# EAGLE design Adafruit 0.96in 160x80 TFT Display (EAGLE 6.4)
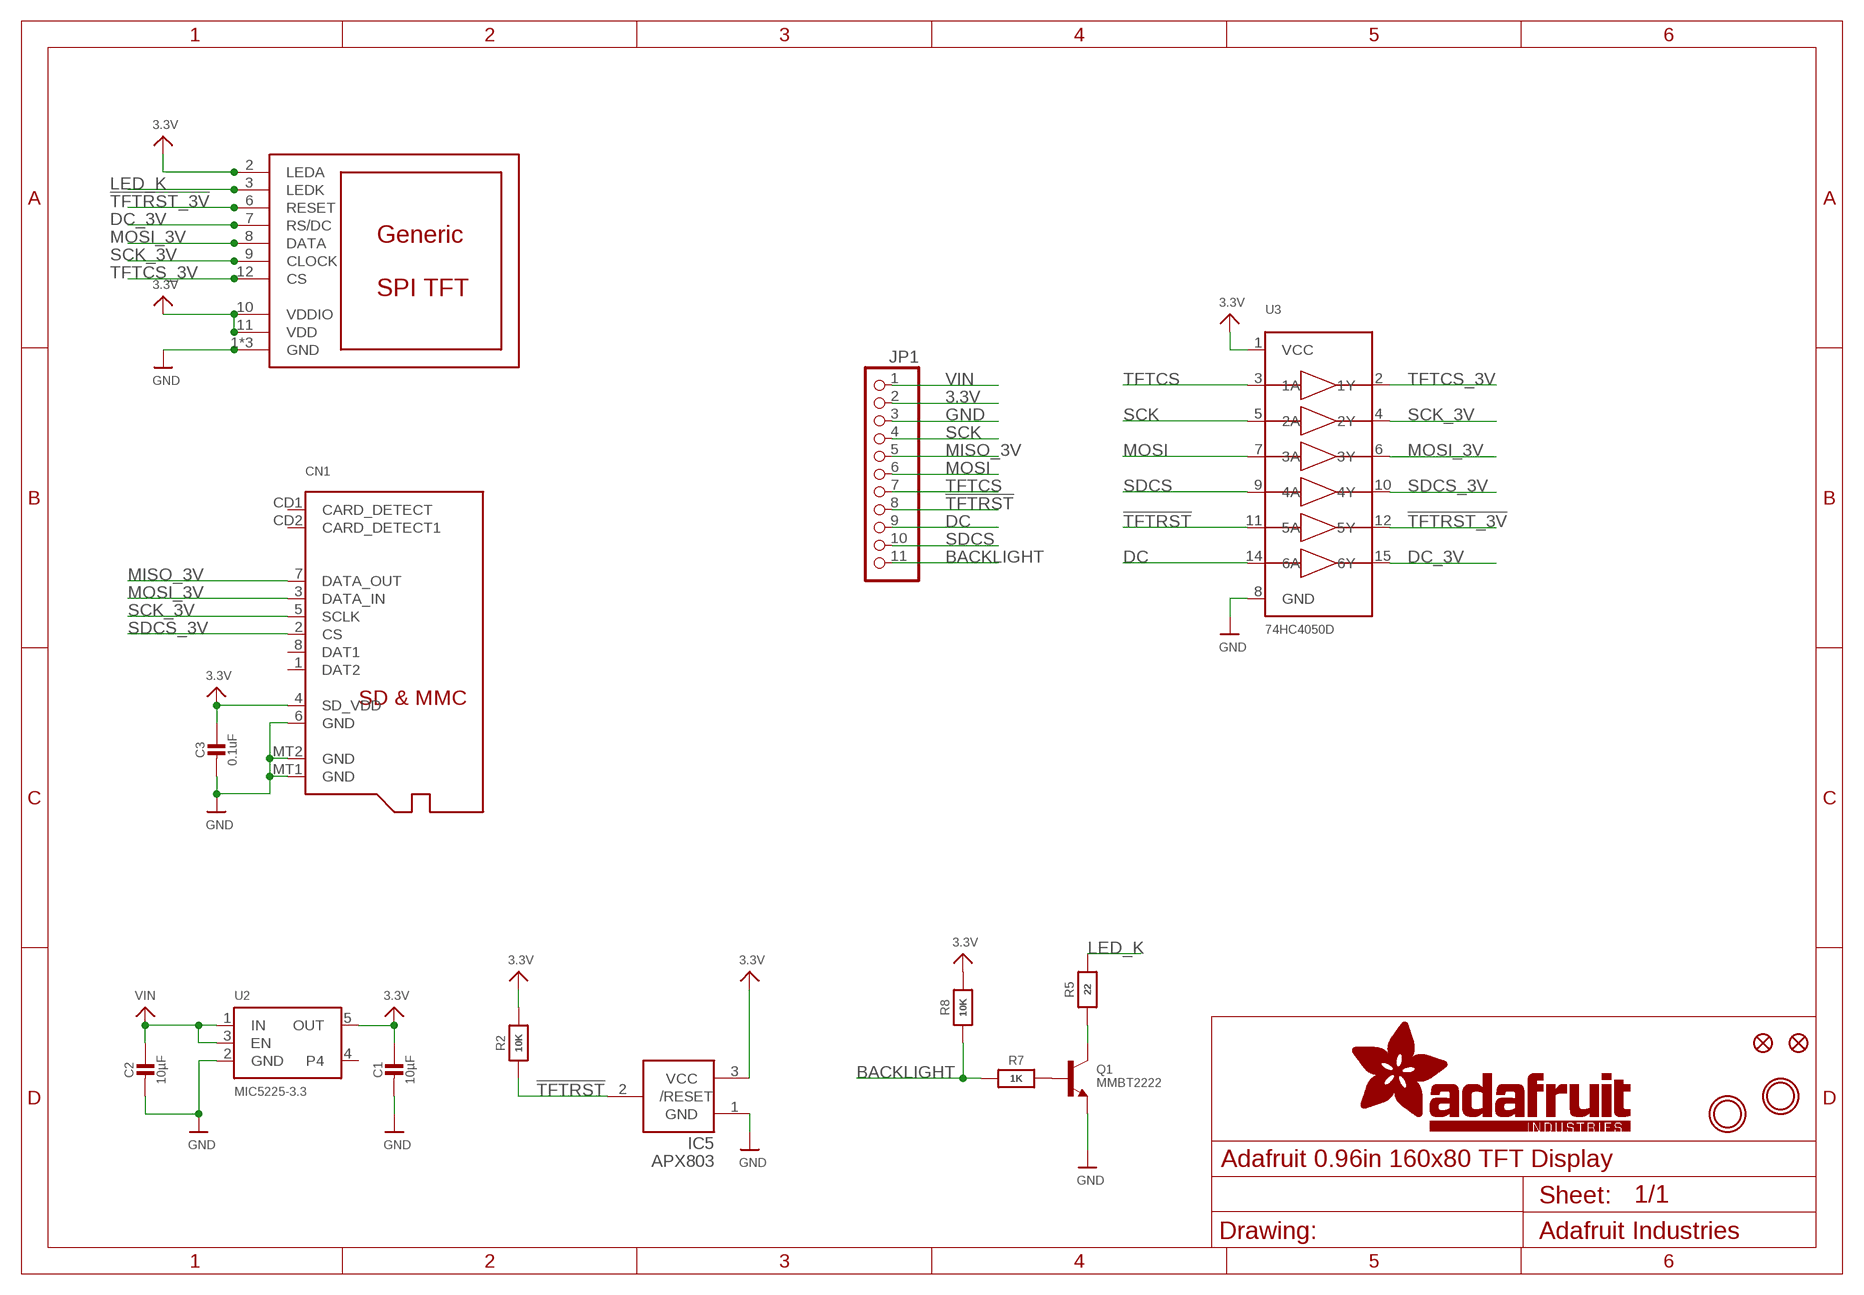
[diagram p0: schematic, sheet 1]

## Parts
C1  10µF  CAP_CERAMIC0805-NOOUTLINE  [0805-NO]
C2  10µF  CAP_CERAMIC0805-NOOUTLINE  [0805-NO]
C3  0.1uF  CAP_CERAMIC0805-NOOUTLINE  [0805-NO]
CN1  MICROSD  [MICROSD]
FID1  FIDUCIAL_1MM  [FIDUCIAL_1MM]
FID2  FIDUCIAL_1MM  [FIDUCIAL_1MM]
IC5  APX803  AXP083-SAG  [SOT23]
JP1  HEADER-1X11  [1X11_ROUND]
Q1  MMBT2222  TRANSISTOR_NPNWIDE  [SOT23-WIDE]
R2  10K  RESISTOR_0603_NOOUT  [0603-NO]
R5  22  RESISTOR_0603_NOOUT  [0603-NO]
R7  1K  RESISTOR_0603_NOOUT  [0603-NO]
R8  10K  RESISTOR_0603_NOOUT  [0603-NO]
U2  MIC5225-3.3  VREG_SOT23-5  [SOT23-5]
U3  74HC4050D  [SOIC16]
U$2  DISP_LCD_0.9IN_160X80  [TFT_0.96IN_160X80]
U$9  MOUNTINGHOLE2.5  [MOUNTINGHOLE_2.5_PLATED]
U$10  MOUNTINGHOLE2.5  [MOUNTINGHOLE_2.5_PLATED]

## Nets
3.3V: C1.1 C3.1 CN1.4(SD_VDD) IC5.3(VCC) JP1.2 R2.2 R8.2 U2.5(OUT) U3.1(VCC) U$2.2(LEDA) U$2.10(VDDIO) U$2.11(VDD)
!TFTRST: IC5.2(/RESET) JP1.8 R2.1 U3.11(5A)
!TFTRST_3V: U3.12(5Y) U$2.6(RESET)
BACKLIGHT: JP1.11 R7.1 R8.1
DC: JP1.9 U3.14(6A)
DC_3V: U3.15(6Y) U$2.7(RS/DC)
GND: C1.2 C2.2 C3.2 CN1.6(GND) CN1.MT1(GND) CN1.MT2(GND) IC5.1(GND) JP1.3 Q1.2(E) U2.2(GND) U3.8(GND) U$2.1(GND) U$2.5(GND) U$2.13(GND)
LED_K: R5.2 U$2.3(LEDK)
MISO_3V: CN1.7(DATA_OUT) JP1.5
MOSI: JP1.6 U3.7(3A)
MOSI_3V: CN1.3(DATA_IN) U3.6(3Y) U$2.8(DATA)
N$1: Q1.1(B) R7.2
N$5: Q1.3(C) R5.1
SCK: JP1.4 U3.5(2A)
SCK_3V: CN1.5(SCLK) U3.4(2Y) U$2.9(CLOCK)
SDCS: JP1.10 U3.9(4A)
SDCS_3V: CN1.2(CS) U3.10(4Y)
TFTCS: JP1.7 U3.3(1A)
TFTCS_3V: U3.2(1Y) U$2.12(CS)
VIN: C2.1 JP1.1 U2.1(IN) U2.3(EN)
Unconnected: CN1.1(DAT2) CN1.8(DAT1) CN1.CD1(CARD_DETECT) CN1.CD2(CARD_DETECT1) U2.4

## Library data of the parts
C1-C3 = microbuilder:CAP_CERAMIC: Ceramic Capacitors For new designs, use the packages preceded by an '_' character since they are more reliable: The following footprints should be used on most boards: _0402 - Standard footprint for regular board layouts _0603 - Standard footprint for regular board layouts _0805 - Standard footprint for regular board layouts _1206 - Standard footprint for regular board layouts For extremely tight-pitch boards where space is at a premium, the following 'micro-pitch' footprints can be used (smaller pads, no silkscreen outline, etc.): _0402MP - Micro-pitch footprint for very dense/compact boards _0603MP - Micro-pitch footprint for very dense/compact boards _0805MP - Micro-pitch footprint for very dense/compact boards _1206MP - Micro-pitch footprint for very dense/compact boards
CN1 = microbuilder:MICROSD: MicroSD/Transflash Card Holder with SPI pinout 3M: 2908-05WB-MG 4UConnector: 19656 Footprint courtesy: Adafruit Industries
FID1 FID2 = microbuilder:FIDUCIAL: Fiducial Alignment Points Various fiducial points for machine vision alignment.; BOM: EXCLUDE
IC5 = adafruit:AXP083
JP1 = microbuilder:HEADER-1X11
Q1 = microbuilder:TRANSISTOR_NPN: NPN Transistor Transistor (NPN) 500mA 45V - BC817 [Digikey: 568-1631-1-ND] Transistor (NPN) 500mA 45V - BC817,215 [Mouser: 771-BC817-T/R] SOT23-R - SOT23 footprint optimised for use with solder paste and reflow ovens. SOT23-W - SOT23 footprint optimised for hand-soldering (larger pads).
R2 R5 R7 R8 = microbuilder:RESISTOR: Resistors For new designs, use the packages preceded by an '_' character since they are more reliable: The following footprints should be used on most boards: _0402 - Standard footprint for regular board layouts _0603 - Standard footprint for regular board layouts _0805 - Standard footprint for regular board layouts _1206 - Standard footprint for regular board layouts For extremely tight-pitch boards where space is at a premium, the following 'micro-pitch' footprints can be used (smaller pads, no silkscreen outline, etc.): _0402MP - Micro-pitch footprint for very dense/compact boards _0603MP - Micro-pitch footprint for very dense/compact boards _0805MP - Micro-pitch footprint for very dense/compact boards _1206MP - Micro-pitch footprint for very dense/compact boards
U2 = microbuilder:VREG_SOT23-5: SOT23-5 Fixed Voltage Regulators Part Current Out V Out V In V Dropout θJA (°C/W) TJ (°C) Digikey Part No. ADP121 150mA 3.3V 3.4-5.5V 0.09V @ 150mA -- -- ADP121-AUJZ33R7CT-ND ADP121 150mA 3.0V 3.1-5.5V 0.09V @ 150mA -- -- ADP121-AUJZ30R7CT-ND ADP122 300mA 3.3V 3.4-5.5V 0.085V @ 300mA -- -- ADP122AUJZ-3.3-R7CT-ND ADP1712 300mA 3.3V 3.5-5.5V 0.17V @ 300mA -- -- ADP1712AUJZ-3.3-R7TR-ND AP7311 (Low Cost) 150mA 3.3V 3.5-6V 0.15V @ 150mA -- -- AP7311-33WG-7DICT-ND LD39015M18R 150mA 1.8V 1.9V-5.5V 0.08V @ 100mA -- -- 497-6977-1-ND LP2985A-33DBVR 150mA 3.3V 3.3-16V 0.28V @ 150mA 206 150 296-18479-1-ND MCP1824T-3302E/OT 300mA 3.3V 3.5V-6V 0.2V @ 300mA -- -- MCP1824T-3302E/OTCT-ND MIC5205-2.5YM5 TR 150mA 2.5V 2.7-16V 0.165V @ 150mA -- -- 576-1257-2-ND MIC5205-3.0YM5 TR 150mA 3.0V 3.2V-16V 0.165V @ 150mA -- -- 576-1258-2-ND MIC5205-3.3YM5 TR 150mA 3.3V 3.5V-16V 0.165V @ 150mA -- -- 576-1259-2-ND TPS780330220 150mA 3.3V+2.2V 3.6-5.5V 250mV Max -- -- 296-23332-1-ND TDA3663/N1,135 100mA 3.3V 3.5-45V 0.18V @ 50mA -- -- 568-5343-1-ND Max operating temp can be calculated using θJA, TJ (max junction temperature), and power in watts. Set the "Maximum Ambient Temperature" until it reaches TJ ("Max Junction Temperature"), which is the absolute limit for safe use of the regulator: Heat Sink Temperature Calculator <http://www.daycounter.com/Calculators/Heat-Sink-Temperature-Calculator.phtml> For example, With 12V source into a 3.3V LP2985 and a 30mA load, we are dissipating (12V-3.3V) * 0.03A = 0.261W. With a θJA of 206 °C/W, a TJ of 150°C, and 261mW we can safely use the chip without a heat sink up to 75°C (=147.1°C Junction Temperature).
U3 = microbuilder:74HC4050D: 6-channel level shifter 74HC4050D - 2V-6V Supply SOIC16 Digikey: 74HC4050D,653-ND Mouser: 771-74HC4050D-T TSSOP16 Digikey: 296-9215-1-ND Mouser:
U$2 = microbuilder:DISP_LCD_0.9IN_160X80
U$9 U$10 = microbuilder:MOUNTINGHOLE: Mounting Hole For #2 screws (0.086"/2.18mm width, 0.094"/2.4mm hole) use 2.5mm; BOM: EXCLUDE

## Board
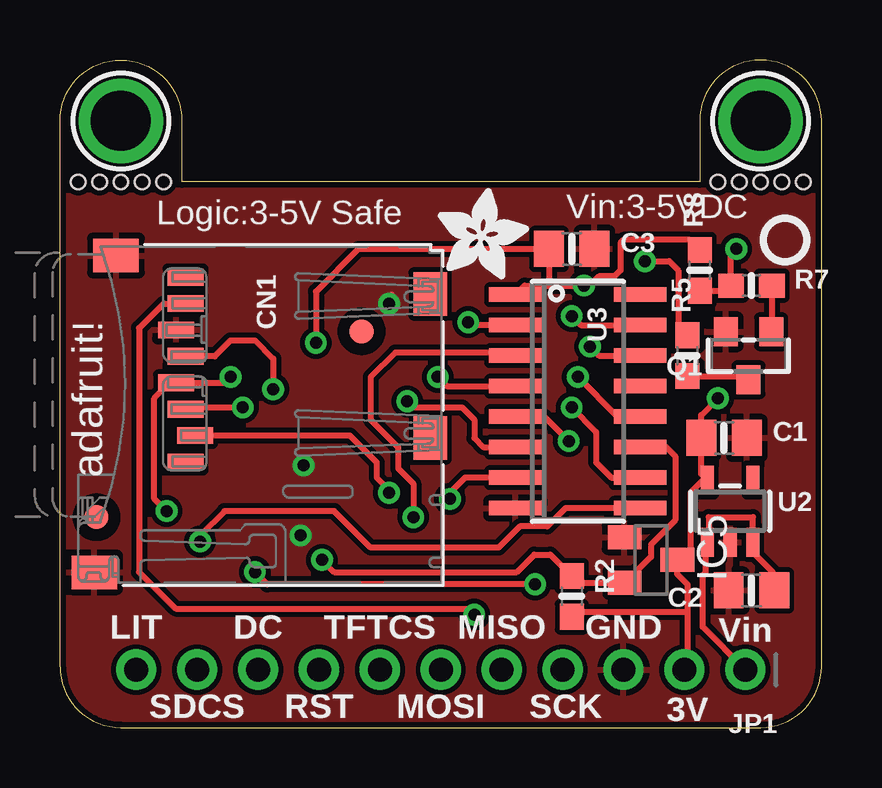
[diagram p1: board, top side]
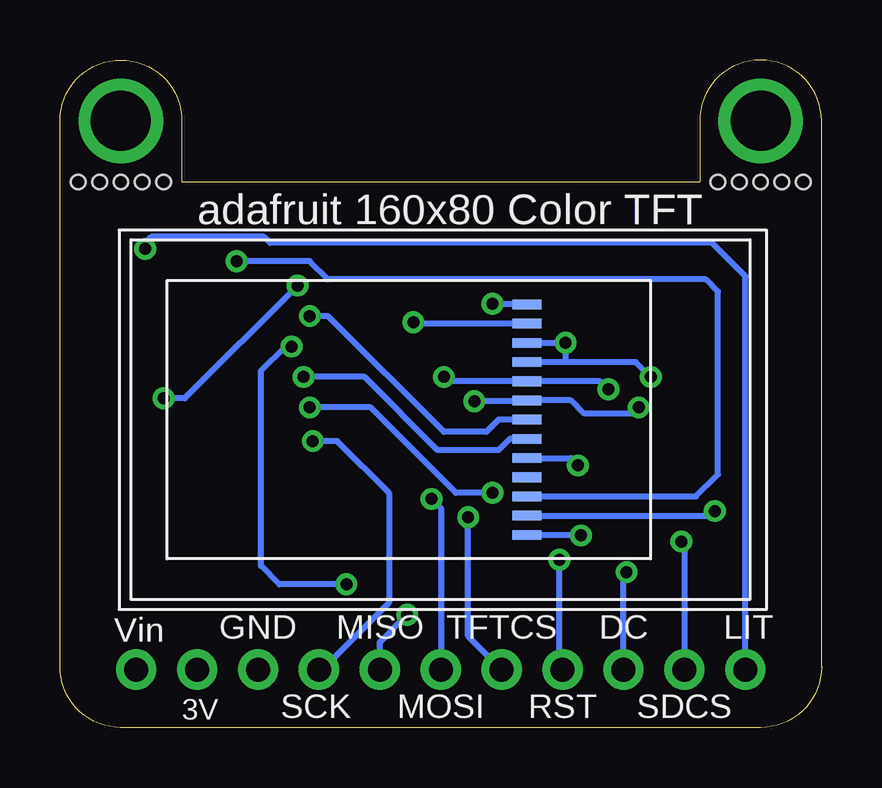
[diagram p2: board, bottom side, seen from below]

Size 31.75 x 27.81 mm. Coordinates in mm from the lower left corner, seen from the top.
Outline: 0,2.54 0,25.27 arc-90 2.54,27.81 arc-90 5.08,25.27 5.08,22.73 26.67,22.73 26.67,25.27 arc-90 29.21,27.81 arc-90 31.75,25.27 31.75,2.54 arc-90 29.21,0 2.54,0 arc-90 0,2.54
Copper layers (1*16): Top 0.035mm / dielectric 1.5mm / Bottom 0.035mm
Design rules "adafruit *": minimum track width 8mil, minimum drill 15.5mil, track to track 8mil, track to pad 8mil, pad to pad 8mil, via to via 8mil, smd to smd 8mil, copper to edge 10mil, drill to drill 8mil, minimum pad ring 10mil, minimum via ring 8mil, stop-mask expansion 2mil, vias tented up to drill 20mil, thermal gap 10mil
Holes 0.6 mm at 4.32,22.73 3.43,22.73 2.54,22.73 1.65,22.73 0.76,22.73 30.99,22.73 30.1,22.73 29.21,22.73 28.32,22.73 27.43,22.73

### Footprints (pad centres in the part's own frame; a part is rotated, then mirrored left to right if it is on the bottom)
0805-NO = smd 1.24 x 1.5: 1 -0.95,0; 2 0.95,0
MICROSD = smd 0.7 x 1.5: 1 9,-10.64; 2 7.9,-10.24; 3 6.8,-10.64; 4 5.7,-11.04; 5 4.6,-10.64; 6 3.5,-11.04; 7 2.4,-10.64; 8 1.3,-10.64 | smd 1.8 x 1.4: CD1 2,-0.44; CD2 8,-0.44 | smd 1.4 x 1.9: MT1 0.4,-13.54; MT2 13.6,-14.44
FIDUCIAL_1MM = smd 1 x 1: 1 0,0
SOT23 = smd 1 x 1.4: 1 -0.95,-1.1; 2 0.95,-1.1; 3 0,1.1
1X11_ROUND = drill 1 pad 1.676: 1 -12.7,0; 2 -10.16,0; 3 -7.62,0; 4 -5.08,0; 5 -2.54,0; 6 0,0; 7 2.54,0; 8 5.08,0; 9 7.62,0; 10 10.16,0; 11 12.7,0
SOT23-WIDE = smd 1 x 1.2: 1 -0.95,-1; 2 0.95,-1; 3 0,1
0603-NO = smd 1.075 x 1: 1 -0.85,0; 2 0.85,0
SOT23-5 = smd 0.55 x 1.2: 1 -0.95,-1.3; 2 0,-1.3; 3 0.95,-1.3; 4 0.95,1.3; 5 -0.95,1.3
SOIC16 = smd 0.6 x 2.2: 1 -4.445,-2.6; 2 -3.175,-2.6; 3 -1.905,-2.6; 4 -0.635,-2.6; 5 0.635,-2.6; 6 1.905,-2.6; 7 3.175,-2.6; 8 4.445,-2.6; 9 4.445,2.6; 10 3.175,2.6; 11 1.905,2.6; 12 0.635,2.6; 13 -0.635,2.6; 14 -1.905,2.6; 15 -3.175,2.6; 16 -4.445,2.6
TFT_0.96IN_160X80 = smd 0.4 x 1.2: 1 -4.8,10; 2 -4,10; 3 -3.2,10; 4 -2.4,10; 5 -1.6,10; 6 -0.8,10; 7 0,10; 8 0.8,10; 9 1.6,10; 10 2.4,10; 11 3.2,10; 12 4,10; 13 4.8,10
MOUNTINGHOLE_2.5_PLATED = drill 2.5 pad 3.2: P$1 0,0

### Placement (x,y rotation side)
C1  27.69,12.06 0 top
C2  28.83,5.71 180 top
C3  21.34,19.94 0 top
CN1  15.88,20.07 270 top
FID1  1.52,8.76 0 top
FID2  12.57,16.51 0 top
IC5  24.64,6.98 270 top
JP1  15.88,2.41 180 top
Q1  28.7,15.49 180 top
R2  21.34,5.46 270 top
R5  26.16,15.49 90 top
R7  28.83,18.41 0 top
R8  26.67,19.05 90 top
U2  27.94,9.02 0 top
U3  21.59,13.59 270 top
U$2  2.29,12.83 90 bottom
U$4  MICROSD  [ADAFRUIT_3.5MM]  15.75,18.67 0 top
U$6  [PCBFEAT-REV-040]  30.23,20.32 0 top
U$9  2.54,25.27 0 top
U$10  29.21,25.27 0 top

### Tracks (layer width: path | path; a pad name or v marks a point on that pad's centre or on a via)
3.3V  (via drill 0.5)
  Top 0.254: v10.67,16.03 10.67,18.16 12.45,19.94 C3.1 20.39,18.41 | 18.29,18.16 19.12,18.16 U3.1 19.37,18.41 20.39,18.41 | 26.16,4.83 26.16,5.97 25.74,6.39 IC5.3 26.29,6.98 26.29,9.78 26.83,10.32 U2.5 26.74,10.57 C1.1 26.74,13.02 v27.43,13.72 | 26.16,4.83 26.16,2.54 JP1.2 | 20.39,18.41 v21.84,18.41 | v4.45,9.02 3.94,9.53 3.94,13.72 4.59,14.37 CN1.4 6.87,14.37 v7.11,14.61 | R8.2 26.25,20.32 23.5,20.32 23.37,20.19 23.37,19.05 23.11,18.8 22.48,18.8 22.1,18.41 v21.84,18.41 | 26.16,4.83 21.55,4.83 R2.2 | 21.84,18.67 v21.84,18.41
  Bottom 0.254: 10.67,15.23 7.76,15.23 7.14,14.61 v7.11,14.61 | 10.67,15.23 U$2.10 | U$2.11 v10.67,16.03 10.67,15.23 | v21.84,18.41 26.54,13.72 v27.43,13.72 | U$2.2 4.63,8.83 v4.45,9.02
!TFTRST  (via drill 0.5)
  Top 0.254: v10.92,6.98 11.43,6.48 19.05,6.48 19.77,7.2 20.45,7.2 R2.1 21.61,6.04 IC5.2 23.56,6.04 24.64,7.11 24.64,7.62 25.65,8.64 25.65,11.3 25.27,11.68 U3.11 24.13,11.68
  Bottom 0.254: JP1.8 10.92,2.54 v10.92,6.98
!TFTRST_3V  (via drill 0.5)
  Top 0.254: v21.59,14.61 23.24,12.95 U3.12
  Bottom 0.254: U$2.6 12.99,12.03 13.46,11.56 16,11.56 19.05,14.61 v21.59,14.61
BACKLIGHT  (via drill 0.5)
  Top 0.254: R8.1 27.76,18.2 R7.1 27.98,19.72 v28.19,19.94
  Bottom 0.254: JP1.11 3.17,18.8 4.57,20.19 22.99,20.19 23.24,20.45 27.94,20.45 28.19,20.19 v28.19,19.94
DC  (via drill 0.5)
  Top 0.254: v19.81,5.97 8.64,5.97 v8.13,6.48 | v22.1,15.88 22.48,15.49 U3.14
  Bottom 0.254: v22.1,15.88 22.35,15.88 23.37,14.86 23.37,6.73 22.61,5.97 v19.81,5.97 | JP1.9 8.25,6.35 v8.13,6.48
DC_3V  (via drill 0.5)
  Top 0.254: v21.34,17.14 21.72,16.76 U3.15
  Bottom 0.254: U$2.7 13.46,12.83 13.97,12.32 15.75,12.32 20.57,17.14 v21.34,17.14
GND  (via drill 0.5)
  Top 0.254: v13.72,17.65 13.72,17.91 13.84,18.03
  Bottom 0.254: U$2.5 10.46,11.23 v10.16,10.92 | U$2.13 13.69,17.63 v13.72,17.65 | U$2.1 10.06,8.03 v10.03,8
  pour Top: 0,22.73 0,0 31.75,0 31.75,22.73
LED_K  (via drill 0.5)
  Top 0.254: v24.38,19.43 25.4,19.43 25.78,19.05 25.78,16.76 26.2,16.34 R5.2
  Bottom 0.254: U$2.3 5.23,9.63 4.32,10.54 4.32,18.16 4.83,18.67 20.57,18.67 21.34,19.43 v24.38,19.43
MISO_3V  (via drill 0.5)
  Top 0.254: v17.27,4.7 17.27,4.95 4.83,4.95 3.3,6.48 3.3,16.64 4.33,17.67 CN1.7
  Bottom 0.254: JP1.5 18.41,3.56 v17.27,4.7
MOSI  (via drill 0.5)
  Top 0.254: U3.7 16.89,10.41 16.26,9.78 v16.26,9.53
  Bottom 0.254: v16.26,9.53 15.88,9.14 JP1.6
MOSI_3V  (via drill 0.5)
  Top 0.254: v14.48,13.59 14.73,13.34 16.76,13.34 17.27,12.83 17.27,12.06 17.65,11.68 U3.6 | CN1.3 5.3,13.34 v7.62,13.34
  Bottom 0.254: v7.62,13.34 7.87,13.08 9.91,13.08 10.45,13.63 U$2.8 12.32,13.59 v14.48,13.59
N$1
  Top 0.254: R7.2 29.68,16.52 Q1.1
N$5
  Top 0.254: R5.1 28.55,14.64 Q1.3
SCK  (via drill 0.5)
  Top 0.254: U3.5 20.19,12.95 v21.21,11.94
  Bottom 0.254: v21.21,11.94 20.19,11.94 18.03,9.78 18.03,5.21 20.83,2.41 JP1.4
SCK_3V  (via drill 0.5)
  Top 0.254: v8.89,14.1 8.89,15.37 8.13,16.13 7.11,16.13 6.45,15.47 CN1.5 | v15.75,14.61 16.13,14.22 U3.4
  Bottom 0.254: v8.89,14.1 9.22,14.43 U$2.9 15.57,14.43 v15.75,14.61
SDCS  (via drill 0.5)
  Top 0.254: U3.9 21.08,9.14 20.32,8.38 19.18,8.38 18.29,7.49 12.95,7.49 11.43,9.02 6.86,9.02 5.84,8 v5.84,7.75
  Bottom 0.254: v5.84,7.75 5.71,7.62 JP1.10
SDCS_3V  (via drill 0.5)
  Top 0.254: v21.34,13.34 22.35,12.32 22.35,11.05 22.99,10.41 U3.10 | v13.72,9.78 13.72,9.91 13.21,10.41 13.21,11.05 12.09,12.17 CN1.2
  Bottom 0.254: v13.72,9.78 15.24,9.78 18.8,13.34 v21.34,13.34
TFTCS  (via drill 0.5)
  Top 0.254: U3.3 18.99,15.62 13.97,15.62 12.95,14.61 12.95,12.83 14.1,11.68 14.1,10.79 14.73,10.16 v14.73,8.76
  Bottom 0.254: JP1.7 14.73,3.81 v14.73,8.76
TFTCS_3V  (via drill 0.5)
  Top 0.254: U3.2 17.14,16.76 v17.02,16.89
  Bottom 0.254: U$2.12 16.95,16.83 v17.02,16.89
VIN
  Top 0.254: JP1.1 26.8,4.19 26.8,6.35 26.92,6.48 26.92,7.65 U2.1 27.05,7.78 27.05,8.76 28.89,8.76 U2.3 28.89,7.3 29.72,6.48 29.72,5.78 C2.1

### Text on the board
tPlace: Logic:3-5V Safe | Vin:3-5VDC | adafruit! | LIT | DC | TFTCS | MISO | GND | Vin | SDCS | RST | MOSI | SCK | 3V
bPlace: adafruit 160x80 Color TFT | LIT | DC | TFTCS | MISO | GND | Vin | SDCS | RST | MOSI | SCK | 3V